# Altium schematic sheet Descriptions.SchDoc
size A4; SheetNumber: 2; SheetTotal: 13
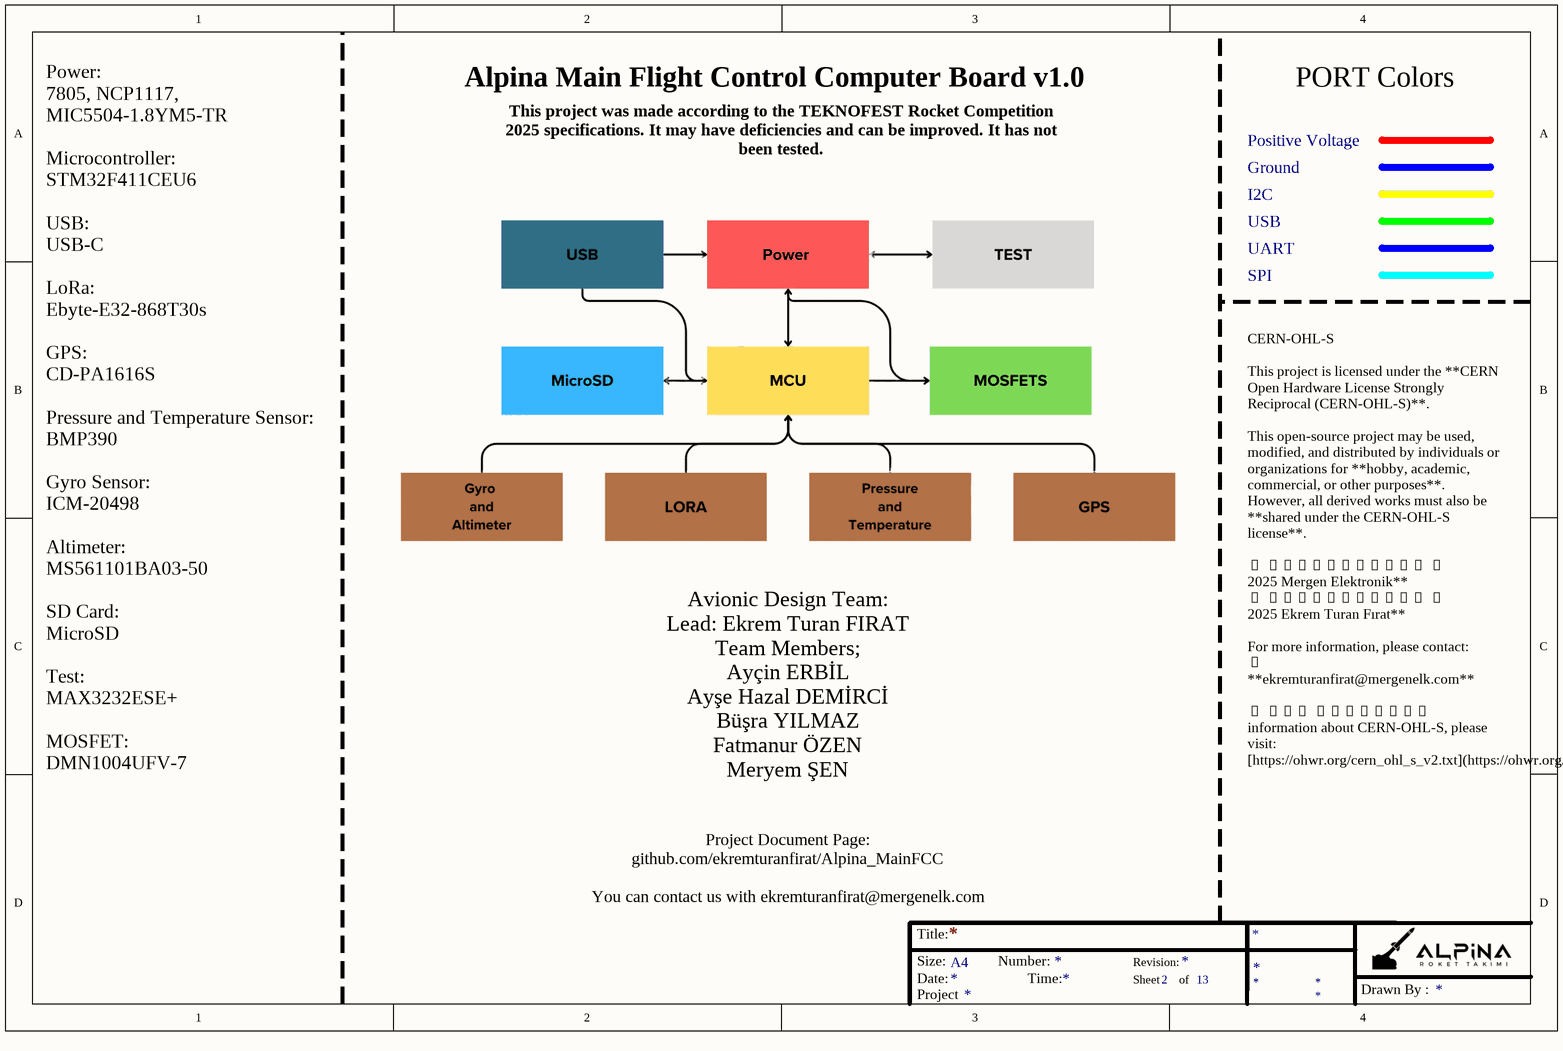
[diagram p0: Descriptions.SchDoc]

## Notes on the sheet
- PORT Colors
- Alpina Main Flight Control Computer Board v1.0
- Positive Voltage
- Ground
- This project was made according to the TEKNOFEST Rocket Competition 2025 specifications. It may have deficiencies and can be improved. It has not been tested.
- I2C
- USB
- UART
- SPI
- Avionic Design Team:
  Lead: Ekrem Turan FIRAT
  Team Members;
  Ayçin ERBİL
  Ayşe Hazal DEMİRCİ
  Büşra YILMAZ
  Fatmanur ÖZEN
  Meryem ŞEN
- CERN-OHL-S
  This project is licensed under the **CERN Open Hardware License Strongly Reciprocal (CERN-OHL-S)**.
  This open-source project may be used, modified, and distributed by individuals or organizations for **hobby, academic, commercial, or other purposes**. However, all derived works must also be **shared under the CERN-OHL-S license**.
  📜 **Copyright © 2025 Mergen Elektronik**
  📜 **Copyright © 2025 Ekrem Turan Fırat**
  For more information, please contact: 📩 **ekremturanfirat@mergenelk.com**
  🔗 For detailed information about CERN-OHL-S, please visit: [https://ohwr.org/cern_ohl_s_v2.txt](https://ohwr.org/cern_ohl_s_v2.txt)
- Power:
  7805, NCP1117, MIC5504-1.8YM5-TR
  Microcontroller:
  STM32F411CEU6
  USB:
  USB-C
  LoRa:
  Ebyte-E32-868T30s
  GPS:
  CD-PA1616S
  Pressure and Temperature Sensor:
  BMP390
  Gyro Sensor:
  ICM-20498
  Altimeter:
  MS561101BA03-50
  SD Card:
  MicroSD
  Test:
  MAX3232ESE+
  MOSFET:
  DMN1004UFV-7
- Project Document Page: github.com/ekremturanfirat/Alpina_MainFCC
  You can contact us with ekremturanfirat@mergenelk.com
- Title:
- Size:
- Date:
- A4
- Number:
- Time:
- Revision:
- Sheet
- of
- Project
- Drawn By :